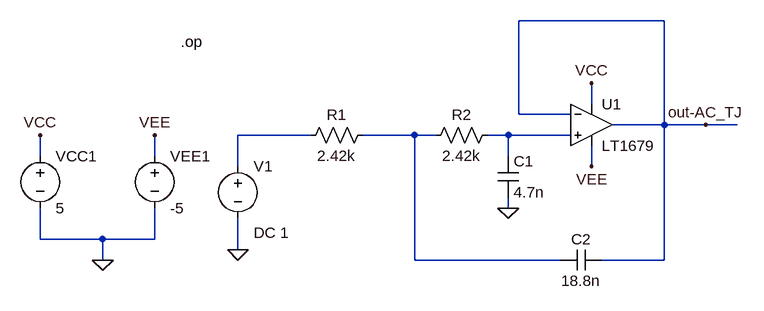
[diagram p0: schematic Etaj_2_Filtru_Sallen_Key_op.asc]
Etaj_2_Filtru_Sallen_Key_op.asc, the LTspice schematic file:
Version 4.1
SHEET 1 880 680
WIRE 480 -112 256 -112
WIRE 368 16 368 -16
WIRE 256 32 256 -112
WIRE 336 32 256 32
WIRE 480 48 480 -112
WIRE 480 48 400 48
WIRE 544 48 480 48
WIRE 592 48 544 48
WIRE -64 64 -176 64
WIRE 96 64 16 64
WIRE 128 64 96 64
WIRE 240 64 208 64
WIRE 336 64 240 64
WIRE -480 96 -480 64
WIRE -304 96 -304 64
WIRE 240 96 240 64
WIRE -176 112 -176 64
WIRE 368 112 368 80
WIRE 240 176 240 160
WIRE -480 224 -480 176
WIRE -384 224 -480 224
WIRE -304 224 -304 176
WIRE -304 224 -384 224
WIRE -176 240 -176 192
WIRE -384 256 -384 224
WIRE 96 256 96 64
WIRE 320 256 96 256
WIRE 480 256 480 48
WIRE 480 256 384 256
FLAG 368 112 VEE
FLAG 368 -16 VCC
FLAG -384 256 0
FLAG -480 64 VCC
FLAG -304 64 VEE
FLAG -176 240 0
FLAG 544 48 out-AC_TJ
FLAG 240 176 0
DATAFLAG 96 64 ""
DATAFLAG 480 -32 ""
SYMBOL voltage -480 80 R0
WINDOW 123 0 0 Left 2
WINDOW 39 0 0 Left 2
SYMATTR InstName VCC1
SYMATTR Value 5
SYMBOL voltage -304 80 R0
WINDOW 123 0 0 Left 2
WINDOW 39 0 0 Left 2
SYMATTR InstName VEE1
SYMATTR Value -5
SYMBOL voltage -176 96 R0
WINDOW 123 24 118 Left 2
WINDOW 39 0 0 Left 2
WINDOW 3 24 146 Left 2
SYMATTR Value2 DC 1
SYMATTR Value ""
SYMATTR InstName V1
SYMBOL res 32 48 R90
WINDOW 0 0 56 VBottom 2
WINDOW 3 32 56 VTop 2
SYMATTR InstName R1
SYMATTR Value 2.42k
SYMBOL res 224 48 R90
WINDOW 0 0 56 VBottom 2
WINDOW 3 32 56 VTop 2
SYMATTR InstName R2
SYMATTR Value 2.42k
SYMBOL cap 224 96 R0
SYMATTR InstName C1
SYMATTR Value 4.7n
SYMBOL cap 384 240 R90
WINDOW 0 0 32 VBottom 2
WINDOW 3 32 32 VTop 2
SYMATTR InstName C2
SYMATTR Value 18.8n
SYMBOL OpAmps\\LT1679 368 48 R0
SYMATTR InstName U1
TEXT -264 -80 Left 2 !.op

The netlist it stands for:
* Etaj_2_Filtru_Sallen_Key_op.asc
VCC1 VCC 0 5
VEE1 VEE 0 -5
V1 N001 0 DC 1
R1 N002 N001 2.42k
R2 N003 N002 2.42k
C1 N003 0 4.7n
C2 out-AC_TJ N002 18.8n
* U1: LT1679 (symbol OpAmps\LT1679 not available, pins judged from their places): In+=N003 In-=out-AC_TJ V+=VCC V-=VEE OUT=out-AC_TJ
.op
.backanno
.end